# EAGLE design EEZ DIB AUX PS r1B1 (EAGLE 7.2.0)
Assembly variants: Farnell, TME

## Sheet 1 of 2: Power board tester
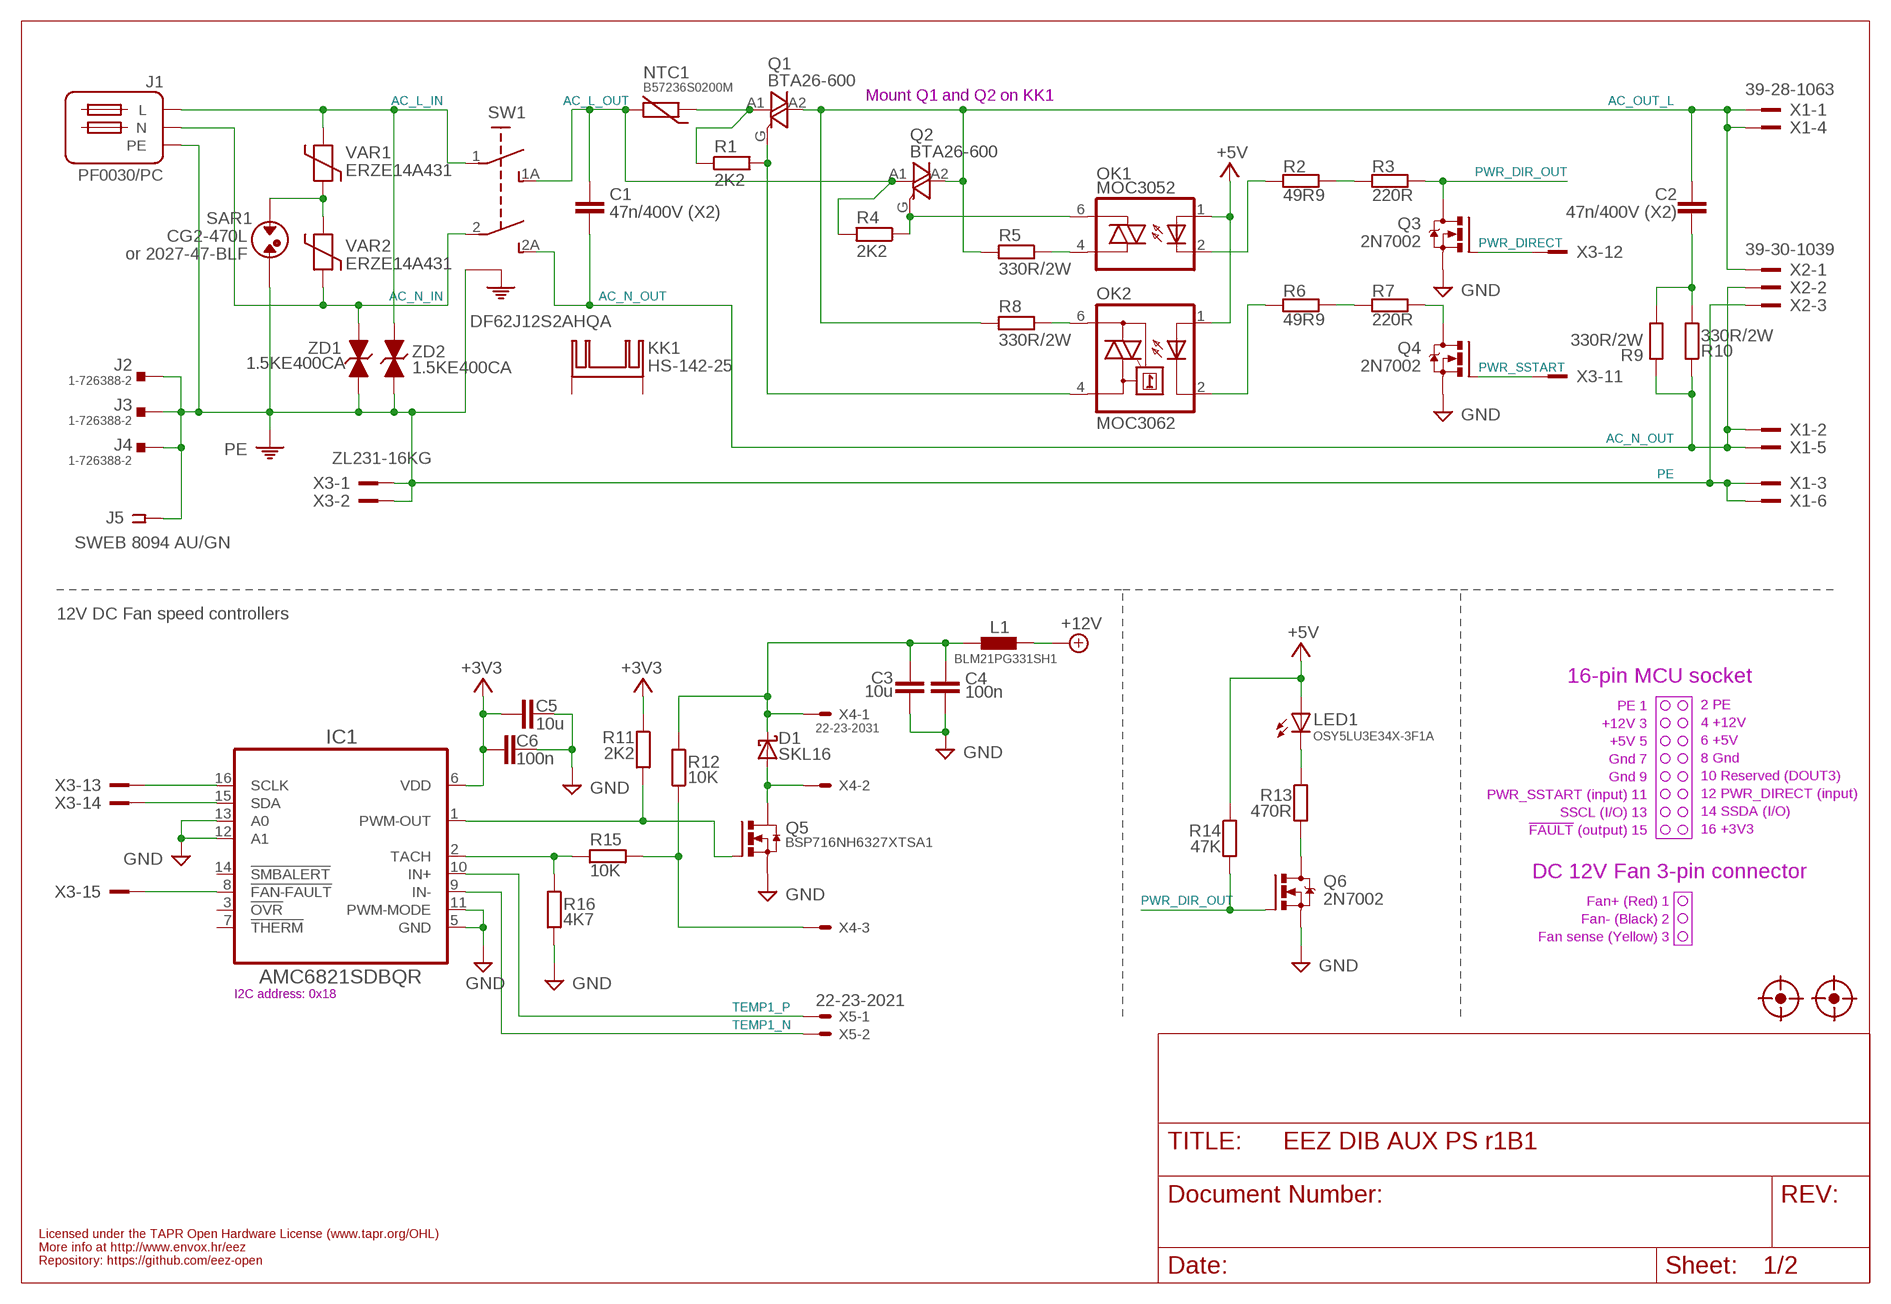
[diagram p0: schematic, sheet 1]

### Parts
C1  47n/400V (X2)  C-EU102-054X133  [C102-054X133]
C2  47n/400V (X2)  C-EU102-054X133  [C102-054X133]
C3  10u  C-EUC1206  [C1206]
C4  100n  C-EUC0603  [C0603]
C5  10u  C-EUC1206  [C1206]
C6  100n  C-EUC0603  [C0603]
D1  SKL16  SCHOTTKYSOD123  [SOD123]
FM1  FIDUCIAL  [FIDUCIAL]
FM2  FIDUCIAL  [FIDUCIAL]
IC1  AMC6821SDBQR  AMC6821  [DBQ16]
J1  PF0030/PC  [PF0030/PC]
J2  1-726388-2  PCB_TAB4.8MM  [PCB_TAB-4.8MM]
J3  1-726388-2  PCB_TAB4.8MM  [PCB_TAB-4.8MM]
J4  1-726388-2  PCB_TAB4.8MM  [PCB_TAB-4.8MM]
J5  SWEB 8094 AU/GN  BINDING_POSTCLIFF  [S16N-PC]
KK1  HS-142-25  SK129-PAD  [SK129]
L1  BLM21PG331SH1  L-EU0805  [0805]
LED1  OSY5LU3E34X-3F1A  LEDOSG8  [OSG8]
NTC1  B57236S0200M  NTC11.5X6  [NTC_11.5X6_RM5]
OK1  MOC3052  MOC305X  [DIL6-SMD]
OK2  MOC3062  MOC3033S  [DIL6-SMD]
Q1  BTA26-600  BTA26-V  [TOP3S-1]
Q2  BTA26-600  BTA26-V  [TOP3S-1]
Q3  2N7002  [SOT103P240X110-3N]
Q4  2N7002  [SOT103P240X110-3N]
Q5  BSP716NH6327XTSA1  N-HEXFET-2D_SOT232-IRLL014N  [SOT223]
Q6  2N7002  [SOT103P240X110-3N]
R1  2K2  R-EU_R0805  [R0805]
R2  49R9  R-EU_R0805  [R0805]
R3  220R  R-EU_R0805  [R0805]
R4  2K2  R-EU_R0805  [R0805]
R5  330R/2W  R-EU_R2512  [R2512]
R6  49R9  R-EU_R0805  [R0805]
R7  220R  R-EU_R0805  [R0805]
R8  330R/2W  R-EU_R2512  [R2512]
R9  330R/2W  R-EU_R2512  [R2512]
R10  330R/2W  R-EU_R2512  [R2512]
R11  2K2  R-EU_R0805  [R0805]
R12  10K  R-EU_R0805  [R0805]
R13  470R  R-EU_R0805  [R0805]
R14  47K  R-EU_R0805  [R0805]
R15  10K  R-EU_R0805  [R0805]
R16  4K7  R-EU_R0805  [R0805]
SAR1  CG2-470L  SAR  [SAR]
SW1  DF62J12S2AHQA  [DF62J12S2]
VAR1  ERZE14A431  VARISTOR-13  [VARISTOR_13MM]
VAR2  ERZE14A431  VARISTOR-13  [VARISTOR_13MM]
X1  39-28-1063  MINIFIT_5566-06A-CRE  [MINIFIT_5566-06A_CRE]
X2  39-30-1039  MINIFIT_39301039-CREEPAGE  [MINIFIT_39301039_CRE]
X3  ZL231-16KG  IDC-16PIN-ANGLED  [ML16L]
X4  22-23-2031  [22-23-2031]
X5  22-23-2021  [22-23-2021]
ZD1  1.5KE400CA  1.5KE-BIDIR  [DO201-BIDIR]
ZD2  1.5KE400CA  1.5KE-BIDIR  [DO201-BIDIR]

### Nets
+3V3: C5.2 C6.2 IC1.6(VDD) R11.1 ; also sheet 2
+5V: LED1.A OK1.1(A) OK2.1(A) R14.1 ; also sheet 2
+12V: L1.2 ; also sheet 2
AC_L_IN: J1.L SW1.1(P) VAR1.2 ZD2.A
AC_L_OUT: C1.1 NTC1.1 Q2.A1 R4.2 SW1.1A(S) ; also sheet 2
AC_N_IN: J1.N SW1.2(P1) VAR2.1 ZD1.A
AC_N_OUT: C1.2 R9.1 R10.1 SW1.2A(S1) X1.2 X1.5 X2.2 ; also sheet 2
AC_OUT_L: C2.1 Q1.A2 Q2.A2 R5.2 R8.2 X1.1 X1.4 X2.1
FAN_OUT: D1.A Q5.2(D) Q5.4(D) X4.2
FAN_SENSE: R12.1 R15.2 X4.3
GND [gnd]: C3.2 C4.2 C5.1 C6.1 IC1.5(GND) IC1.11(PWM-MODE) IC1.12(A1) IC1.13(A0) Q3.2(S) Q4.2(S) Q5.3(S) Q6.2(S) R16.2 ; also sheet 2
N$1: NTC1.2 Q1.A1 R1.1
N$2: IC1.2(TACH) R15.1 R16.1
N$6: SAR1.P$1 VAR1.1 VAR2.2
N$13: Q6.3(D) R13.2
N$14: LED1.C R13.1
N$16: Q4.3(D) R7.2
N$58: IC1.1(PWM-OUT) Q5.1(G) R11.2
N$63: C3.1 C4.1 D1.C L1.1 R12.2 X4.1
N$71: OK1.6(A2) Q2.G R4.1
N$72: OK2.4(A1) Q1.G R1.2
N$73: OK2.6(A2) R8.1
N$74: R2.2 R3.1
N$75: R6.2 R7.1
N$76: OK1.4(A1) R5.1
N$83: C2.2 R9.2 R10.2
N$174: OK2.2(C) R6.1
N$175: OK1.2(C) R2.1
NFAULT: IC1.8(!FAN-FAULT) X3.15
PE: J1.PE J2.P$1 J2.P$2 J3.P$1 J3.P$2 J4.P$1 J4.P$2 J5.1 J5.NC1 J5.NC2 J5.NC3 J5.NC4 SAR1.P$2 SW1.PE1(PE) SW1.PE2(PE) X1.3 X1.6 X2.3 X3.1 X3.2 ZD1.C ZD2.C ; also sheet 2
PWR_DIR_OUT: Q3.3(D) Q6.1(G) R3.2 R14.2
PWR_DIRECT: Q3.1(G) X3.12
PWR_SSTART: Q4.1(G) X3.11
SSCL: IC1.16(SCLK) X3.13
SSDA: IC1.15(SDA) X3.14
TEMP1_N [diff]: IC1.9(IN-) X5.2
TEMP1_P [diff]: IC1.10(IN+) X5.1
Unconnected: IC1.3(!OVR) IC1.7(!THERM) IC1.14(!SMBALERT) KK1.A2,5(K) KK1.B2,5(K) X3.10

### Notes on the sheet
- Mount Q1 and Q2 on KK1
- or 2027-47-BLF
- 12V DC Fan speed controllers
- 16-pin MCU socket
- PE 1
- 2 PE
- +12V 3
- 4 +12V
- +5V 5
- 6 +5V
- Gnd 7
- 8 Gnd
- Gnd 9
- 10 Reserved (DOUT3)
- PWR_SSTART (input) 11
- 12 PWR_DIRECT (input)
- SSCL (I/O) 13
- 14 SSDA (I/O)
- !FAULT! (output) 15
- 16 +3V3
- DC 12V Fan 3-pin connector
- Fan+ (Red) 1
- Fan- (Black) 2
- Fan sense (Yellow) 3
- I2C address: 0x18
- Licensed under the TAPR Open Hardware License (www.tapr.org/OHL)
- More info at http://www.envox.hr/eez
- Repository: https://github.com/eez-open

## Sheet 2 of 2
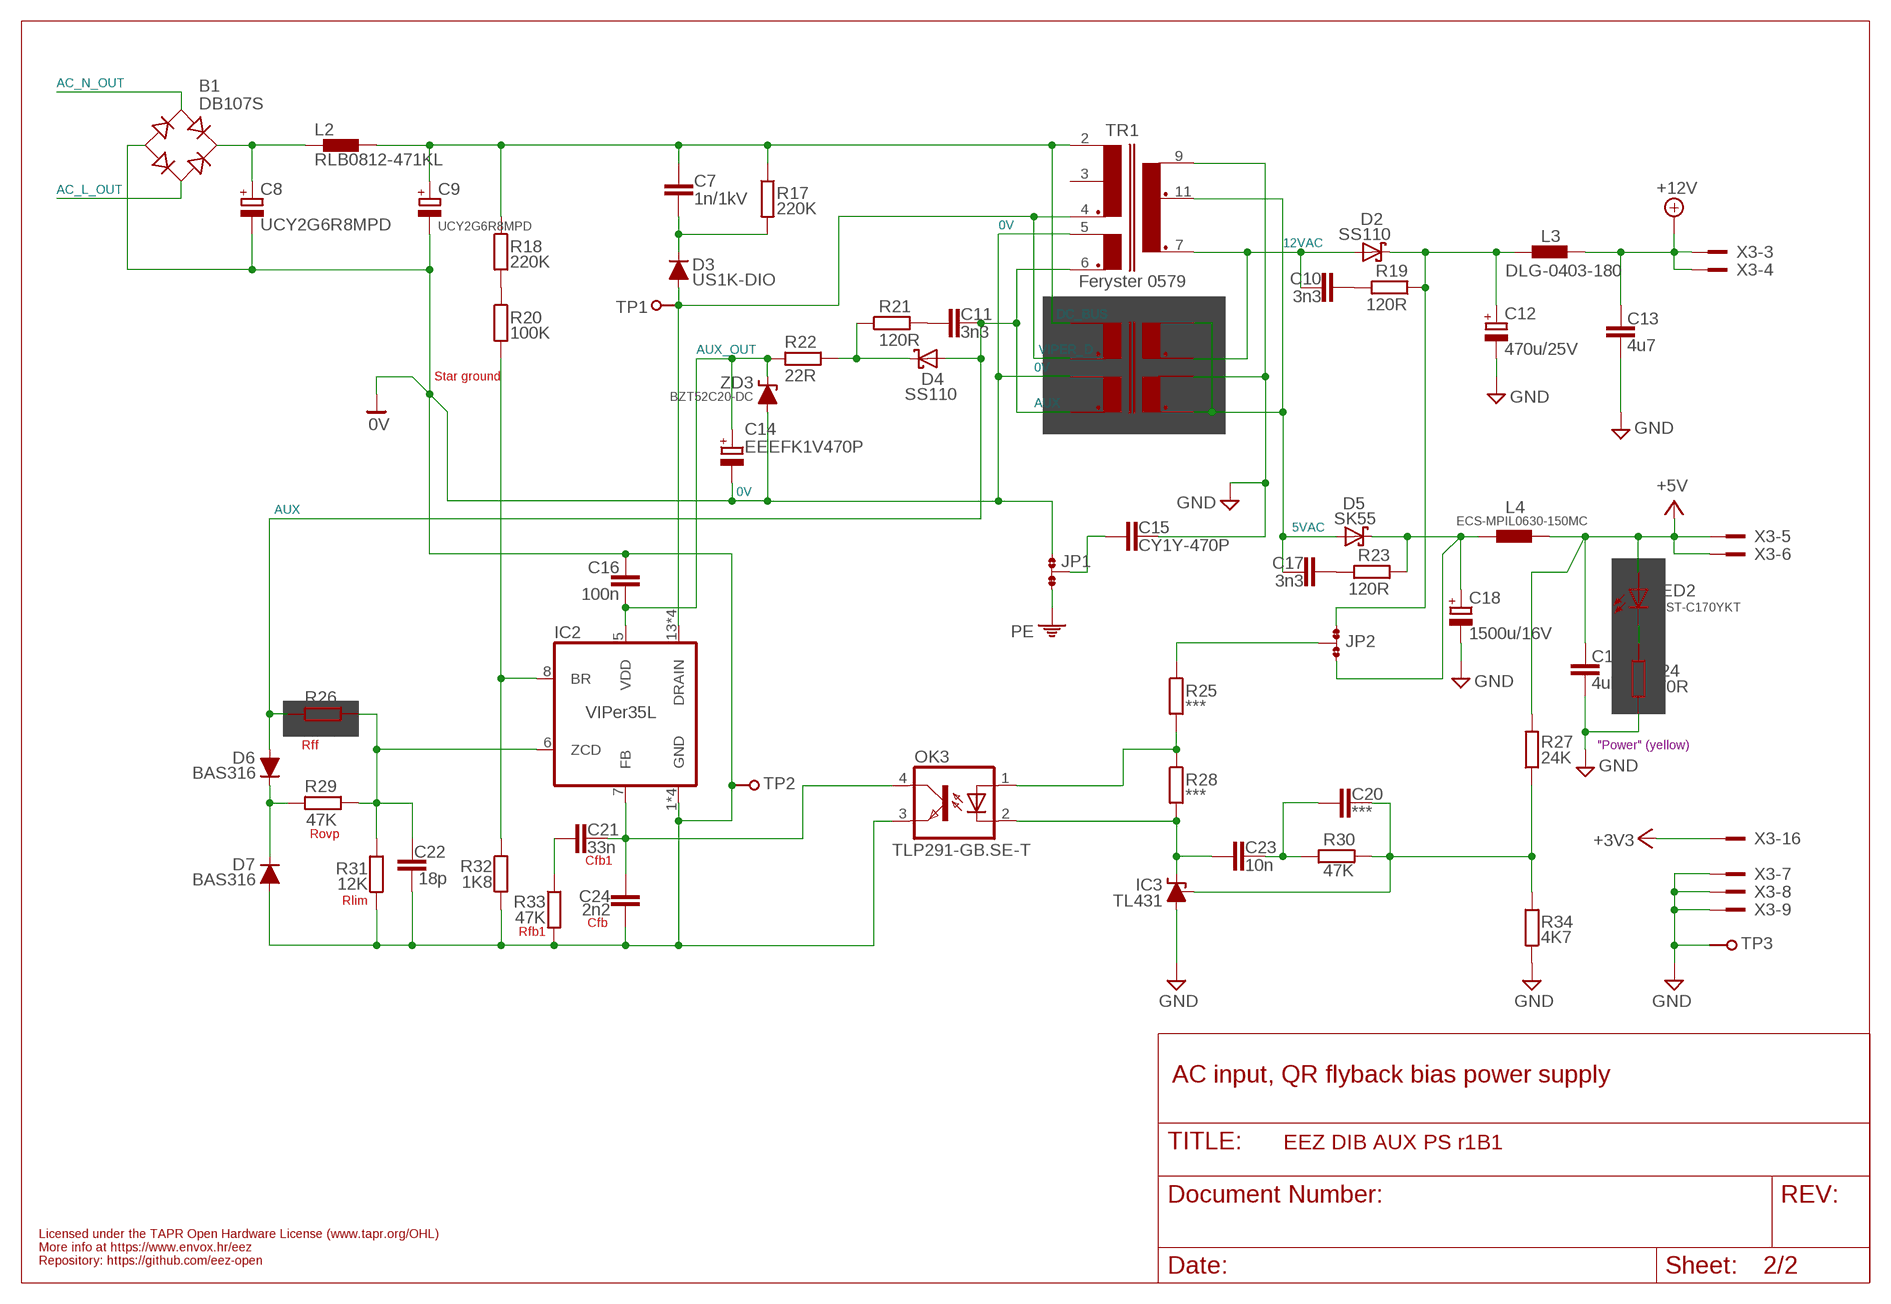
[diagram p1: schematic, sheet 2]

### Parts
B1  DB107S  DBS107G  [DBS]
C7  1n/1kV  C-EUC1210  [C1210]
C8  UCY2G6R8MPD  ECAP5G_10.5MM  [ECAP5/10.5]
C9  UCY2G6R8MPD  ECAP5G_10.5MM  [ECAP5/10.5]
C10  3n3  C-EUC0805  [C0805]
C11  3n3  C-EUC0805  [C0805]
C12  470u/25V  ECAP5G_10.5MM  [ECAP5/10.5]
C13  4u7  C-EUC1206  [C1206]
C14  EEEFK1V470P  ECAPPANASONIC_H  [CAPAE660X610N]
C15  CY1Y-470P  C-EUCY  [CY075-032X103]
C16  100n  C-EUC0603  [C0603]
C17  3n3  C-EUC0805  [C0805]
C18  1500u/16V  ECAP5G_13MM  [ECAP5/13]
C19  4u7  C-EUC1206  [C1206]
C20  ***  C-EUC0805  [C0805]
C21  33n  C-EUC0805  [C0805]
C22  18p  C-EUC0603  [C0603]
C23  10n  C-EUC0805  [C0805]
C24  2n2  C-EUC0805  [C0805]
D2  SS110  SCHOTTKYSMB  [SMB]
D3  US1K-DIO  DIODEDO214AA  [DO214AA]
D4  SS110  SCHOTTKYSMB  [SMB]
D5  SK55  SCHOTTKYSMB  [SMB]
D6  BAS316  DIODESOD323R  [SOD323-R]
D7  BAS316  DIODESOD323R  [SOD323-R]
IC2  VIPer35L  VIPER35  [SOIC-16]
IC3  TL431  [SOT103P240X110-3N]
JP1  JP3-CUT  [JP3-CUT]
JP2  JP3-CUT  [JP3-CUT]
L2  RLB0812-471KL  FERYSTER_DSZ6  [FERSYTER_DSZ6]
L3  DLG-0403-180  DE0403  [DE0403]
L4  ECS-MPIL0630-150MC  DE0704  [DE0704]
LED2  LTST-C170YKT  LED0805  [LED_0805]
OK3  TLP291-GB.SE-T  TLP291  [SO4]
R17  220K  R-EU_R1206  [R1206]
R18  220K  R-EU_R1206  [R1206]
R19  120R  R-EU_R0805  [R0805]
R20  100K  R-EU_R0805  [R0805]
R21  120R  R-EU_R0805  [R0805]
R22  22R  R-EU_R0805  [R0805]
R23  120R  R-EU_R0805  [R0805]
R24  470R  R-EU_R0805  [R0805]
R25  ***  R-EU_R0805  [R0805]
R26  N.C.  R-EU_R0805  [R0805]
R27  24K  R-EU_R0805  [R0805]
R28  ***  R-EU_R0805  [R0805]
R29  47K  R-EU_R0805  [R0805]
R30  47K  R-EU_R0805  [R0805]
R31  12K  R-EU_R0805  [R0805]
R32  1K8  R-EU_R0805  [R0805]
R33  47K  R-EU_R0805  [R0805]
R34  4K7  R-EU_R0805  [R0805]
TP1  PCB_TEST_TABSHIELD  [PCB_SHIELD_TAB]
TP2  PCB_TEST_TABSHIELD  [PCB_SHIELD_TAB]
TP3  PCB_TEST_TABSHIELD  [PCB_SHIELD_TAB]
TR1  Feryster 0579  FERYSTER_0579  [FERYSTER_0579]
TR1B  (WE 760875532)  WE-UOST  [WE-UOST]
ZD3  BZT52C20-DC  ZENER-DIODESOD123  [SOD123]

### Nets
0V: B1.- C8.- C9.- C14.2(-) C16.1 C22.2 C24.2 D7.A IC2.1(GND) IC2.2(GND) IC2.3(GND) IC2.4(GND) JP1.NO OK3.3(EMIT) R31.1 R32.2 R33.2 TP2.1 TR1.5(AUX) TR1B.11(AUX) ZD3.A
5VAC: C17.2 D5.A TR1.11(S1_DOT) TR1B.2(S1) TR1B.3(S2_DOT) TR1B.4(S2_DOT)
12VAC: C10.2 D2.A TR1.7(S2_DOT) TR1B.1(S1_DOT)
+3V3: X3.16 ; also sheet 1
+5V: C19.1 L4.2 LED2.A R27.2 X3.5 X3.6 ; also sheet 1
+5V_REC: C18.+ D5.C JP2.NO L4.1 R23.1
+12V: C13.1 L3.2 X3.3 X3.4 ; also sheet 1
+12V_REC: C12.+ D2.C JP2.NC L3.1 R19.1
AC_L_OUT: B1.AC2 ; also sheet 1
AC_N_OUT: B1.AC1 ; also sheet 1
AUX: C11.2 D4.A D6.A R26.2 TR1.6(AUX_DOT) TR1B.12(AUX_DOT)
AUX_OUT: C14.1(+) C16.2 IC2.5(VDD) R22.2 ZD3.C
AUX_REC: D4.C R21.1 R22.1
DC_BUS: C7.1 C9.+ L2.P$2 R17.1 R18.1 TR1.2(P1) TR1B.7(P1)
FB1: C23.1 IC3.1(C) OK3.2(C) R28.2
GND [gnd]: C12.- C13.2 C15.2 C18.- C19.2 IC3.3(A) R24.2 R34.1 TP3.1 TR1.9(S_COMM) TR1B.5(S2) TR1B.6(S2) X3.7 X3.8 X3.9 ; also sheet 1
N$4: C15.1 JP1.COM
N$5: OK3.1(A) R25.2 R28.1
N$8: C10.1 R19.2
N$9: B1.+ C8.+ L2.P$1
N$10: LED2.C R24.1
N$12: JP2.COM R25.1
N$20: IC2.8(BR) R20.2 R32.1
N$49: R18.2 R20.1
N$137: C7.2 D3.C R17.2
N$138: C21.2 C24.1 IC2.7(FB) OK3.4(COL)
N$140: C11.1 R21.2
N$141: C22.1 IC2.6(ZCD) R26.1 R29.1 R31.2
N$146: C17.1 R23.2
N$148: C20.2 IC3.2(REF) R27.1 R30.2 R34.2
N$149: C20.1 C23.2 R30.1
N$152: C21.1 R33.1
N$155: D6.C D7.C R29.2
PE: JP1.NC ; also sheet 1
VIPER_D: D3.A IC2.13(DRAIN) IC2.14(DRAIN) IC2.15(DRAIN) IC2.16(DRAIN) TP1.1 TR1.4(P1_DOT) TR1B.9(P1_DOT)
Unconnected: TR1.3(P1_MIDDLE)

### Notes on the sheet
- Star ground
- Rff | "Power" (yellow)
- Rovp
- Cfb1
- Rlim
- Cfb
- Rfb1
- AC input, QR flyback bias power supply
- Licensed under the TAPR Open Hardware License (www.tapr.org/OHL)
- More info at https://www.envox.hr/eez
- Repository: https://github.com/eez-open

## Library data of the parts
B1 = rectifier:DB?*G: Single Phase 1.0 AMP Glass Passivated Bridge Rectifier Taiwan Semiconductor Co.,Ltd. - TSC Source: http://www.taiwansemi.com/TSCbig5/ezcatfiles/cust/img/img/db101g.pdf http://www.ts.com.tw/db/pictures/modules/PDT/PDT060207001/DBLS201G.pdf
C1-C7 C10 C11 C13 C16 C17 C19-C24 = rcl:C-EU: CAPACITOR, European symbol
C8 C9 C12 C14 C18 = EEZ_Lib1:ECAP
C15 = EEZ_Lib1:C-EU
D1 D2 D4 D5 = EEZ_Lib1:SCHOTTKY
D3 D6 D7 = EEZ_Lib1:DIODE
FM1 FM2 = EEZ_Lib1:FIDUCIAL: Fiducial mark for pick and place automation
IC1 = EEZ_DIB:AMC6821: Intelligent Temperature Monitor and PWM Fan Controller, I2C; DATASHEETURL: httpwww.ti.comlitgpnAMC6821; FAMILY_NAME: TEMP MONITORING AND FAN CONTROL; GENERIC_PART_NUMBER: AMC6821; INDUSTRY_STD_PKG_TYPE: SSOPQSOP; MANUFACTURER: Texas Instruments; PACKAGE_DESIGNATOR: DBQ; PIN_COUNT: 16
IC2 = EEZ_Lib1:VIPER35: Quasi-resonant high performance off line high voltage converter, 800 V
IC3 = EEZ_Lib1:TL431: Precision programmable reference
J1 = EEZ_connectors:PF0030/PC: PC Flanged Mount Fused Inlet, twin fused 5 x 20 mm, 250 Vac, 10 A, PC spills
J2-J4 = EEZ_connectors:PCB_TAB
J5 = EEZ_Lib1:BINDING_POST: Various 4 mm binding posts
JP1 JP2 = EEZ_Lib1:JP3-CUT: 2-way SMT jumper with one position connected
KK1 = EEZ_DIB:SK129-PAD: Extruded heatsink; SOT32,TO220,TO3P; L:25.4mm; 7.8K/W Compatible model: Stonecold HS-142-25
L1 = EEZ_Lib1:L-EU
L2 = EEZ_Lib1:FERYSTER_DSZ6: Feryster DSZ type choke on RSZ ferrite core
L3 = EEZ_inductors_and_transformers:DE0403: Ferrocore SMD power coil 4.0 x 4.5 mm
L4 = EEZ_inductors_and_transformers:DE0704: Ferrocore SMD power coil 7.3 x 7.3 mm
LED1 LED2 = EEZ_Lib1:LED
NTC1 = EEZ_Lib1:NTC
OK1 = EEZ_Lib1:MOC305X: 6-pin DIP Random-phase Optoisolators Triac Drivers (600V Peak)
OK2 = optocoupler:MOC30*: 6-Pin DIP Zero-Cross Optoisolators Triac Driver Output (250/400 Volt Peak) Source: http://www.fairchildsemi.com/ds/MO/MOC3043-M.pdf; MF: FAIRCHILD SEMICONDUCTOR; MPN: MOC3033S-M; OC_FARNELL: unknown; OC_NEWARK: 05C2878
OK3 = EEZ_Lib1:TLP291: Toshiba Photocopler GaAs IRED & Photo-transistor
Q1 Q2 = triac:BTA26: 25A TRIAC Source: http://www.st.com/stonline/products/literature/ds/7470.pdf
Q3 Q4 Q6 = EEZ_Lib1:2N7002: N-CHANNEL ENHANCEMENT MODE FIELD EFFECT TRANSISTOR; MPN: 2N7002-7-F; OC_FARNELL: 1713823; OC_NEWARK: 25R5679; PACKAGE: SOT-23-3; SUPPLIER: DIODES INC.
Q5 = transistor-power:N-HEXFET-2D_?-*: HEXFET® Power MOSFET 2 Drain connects http://www.irf.com/product-info/datasheets/data/irll014n.pdf
R1-R34 = rcl:R-EU_: RESISTOR, European symbol
SAR1 = EEZ_Lib1:SAR: EPCOS surge arrester EF470X Farnell: 1886596
SW1 = EEZ_switches:DF62J12S2: Rocker switch SPST; Positions:2; OFF-ON; 16A/250VAC; 6A/48VDC
TP1-TP3 = EEZ_Lib1:PCB_TEST_TAB
TR1 = EEZ_inductors_and_transformers:FERYSTER_0579: Flyback transformer, 1.04mH, 35W
TR1B = EEZ_Lib1:WE-UOST: WE-UOST Universal Offline Standard Transformers
VAR1 VAR2 = EEZ_Lib1:VARISTOR: EPCOS - B72220S0251K101 - VARISTOR, 140J, 250VAC Farnell: 1004357
X1 = EEZ_connectors:MINIFIT_5566-06A: Molex Socket; wire-board; male; Mini-Fit Jr; 4.2mm; PIN:6; THT; 9A; tinned
X2 = EEZ_connectors:MINIFIT_39301039: MOLEX socket; wire-board; male; Mini-Fit Jr; 4.2mm; PIN:3; THT; PCB snap
X3 = EEZ_connectors:IDC-16PIN: 16-pin IDC socket
X4 = con-molex:22-23-2031: .100" (2.54mm) Center Header - 3 Pin; MF: MOLEX; MPN: 22-23-2031; OC_FARNELL: 1462950; OC_NEWARK: 30C0862
X5 = con-molex:22-23-2021: .100" (2.54mm) Center Header - 2 Pin; MF: MOLEX; MPN: 22-23-2021; OC_FARNELL: 1462926; OC_NEWARK: 25C3832
ZD1 ZD2 = EEZ_Lib1:1.5KE-BIDIR
ZD3 = EEZ_Lib1:ZENER-DIODE

## Net classes
0 default: width 0.152 mm, drill 0.3 mm, clearance 0.152 mm
1 diff: width 0.254 mm, drill 0.3 mm, clearance 0.254 mm
2 gnd: width 0.152 mm, drill 0.3 mm, clearance 0.152 mm

## Board
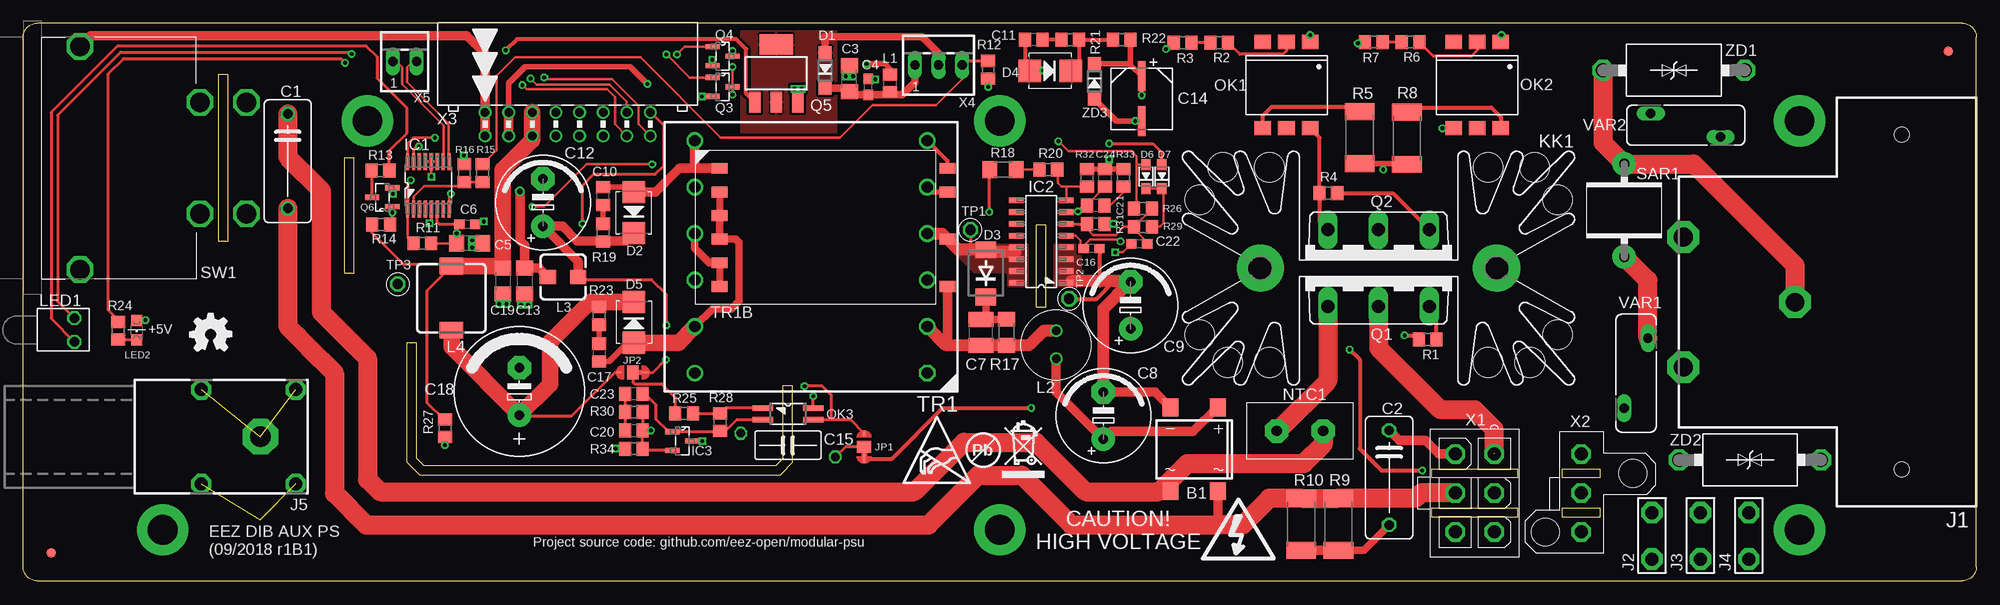
[diagram p2: board, top side]
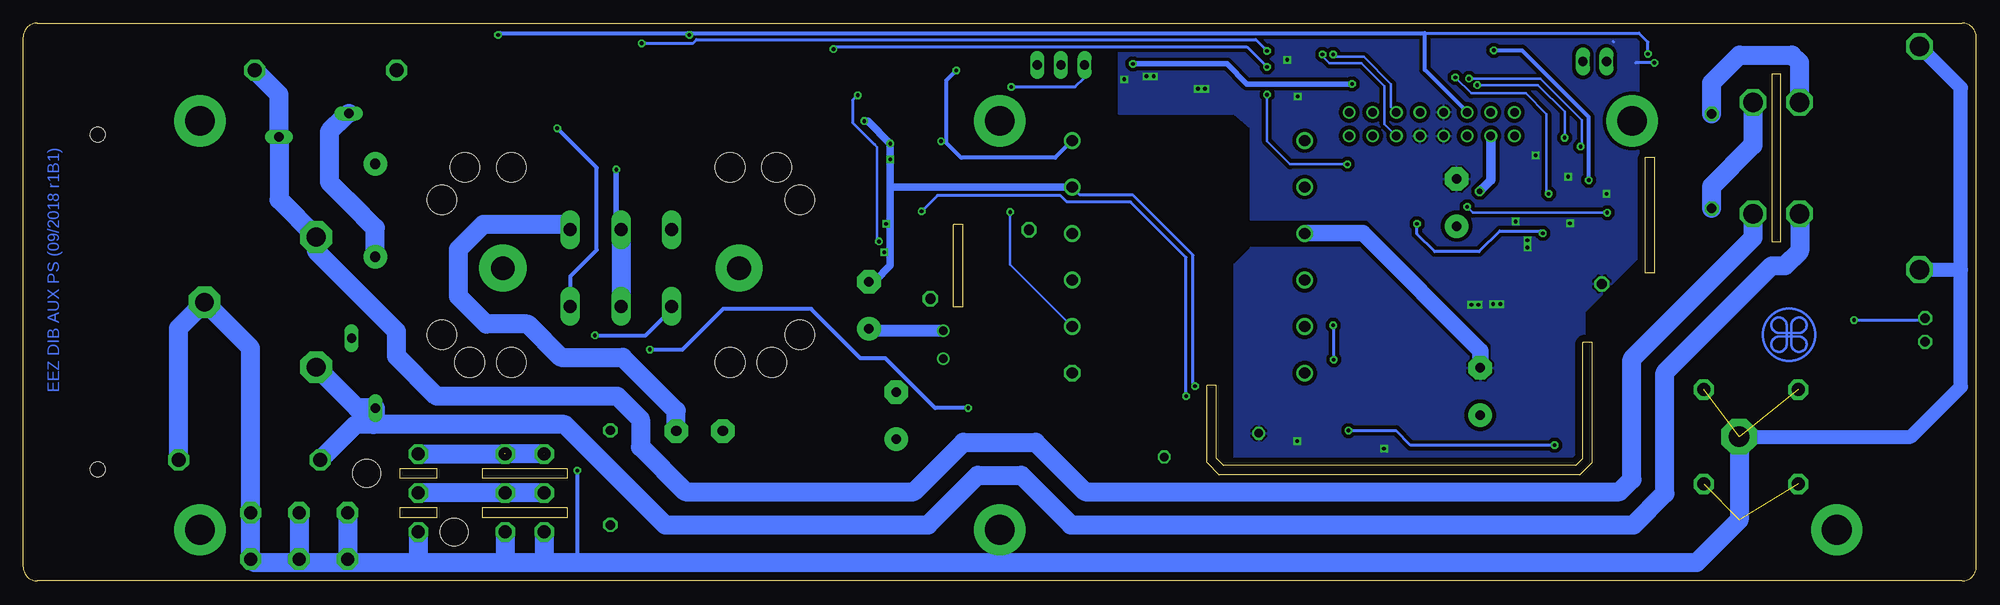
[diagram p3: board, bottom side, seen from below]

Size 210 x 60 mm. Coordinates in mm from the lower left corner, seen from the top.
Outline: 1.5,0 208.5,0 arc90 210,1.5 210,58.5 arc90 208.5,60 1.5,60 arc90 0,58.5 0,1.5 arc90 1.5,0
Outline: 42.61,11.43 81.41,11.43 82.74,12.76 82.74,21.02 81.72,21.02 81.72,13.21 80.96,12.45 43.05,12.45 42.29,13.21 42.29,25.65 41.27,25.65 41.27,12.76 42.61,11.43
Outline: 108.97,29.46 108.97,38.35 109.98,38.35 109.98,29.46 108.97,29.46
Outline: 34.54,33.15 34.54,45.53 35.56,45.53 35.56,33.15 34.54,33.15
Copper layers (1*16): Top 0.035mm / dielectric 1.5mm / Bottom 0.035mm
Design rules "default *": minimum track width 6mil, minimum drill 0.3mm, track to track 4mil, track to pad 4mil, pad to pad 4mil, via to via 4mil, smd to smd 4mil, copper to edge 30mil, drill to drill 8mil, minimum pad ring 4mil, minimum via ring 8mil, stop-mask expansion 2.5mil, vias tented up to drill 0.6mm, thermal gap 8mil
Holes 3.2 mm at 134,44.5 129,44.5 157.5,44.5 162.5,44.5 134,23.5 129.5,23.5 126.5,26.5 126.5,41 165,41 165,26.5 162,23.5 157.5,23.5

### Footprints (pad centres in the part's own frame; a part is rotated, then mirrored left to right if it is on the bottom)
DBS = smd 1.7 x 1.9: + -2.55,-4.5; - 2.55,-4.5; AC1 -2.55,4.5; AC2 2.55,4.5
C102-054X133 = drill 1.016 octagon: 1 -5.08,0; 2 5.08,0
C1206 = smd 1.6 x 1.8: 1 -1.4,0; 2 1.4,0
C0603 = smd 1.1 x 1: 1 -0.85,0; 2 0.85,0
C1210 = smd 1.6 x 2.7: 1 -1.4,0; 2 1.4,0
ECAP5/10.5 = drill 1.016 pad 2.54: + -2.54,0 | drill 1.016 pad 2.54 octagon: - 2.54,0
C0805 = smd 1.3 x 1.5: 1 -0.95,0; 2 0.95,0
CAPAE660X610N = smd 3.251 x 0.762: 1 -2.413,0; 2 2.413,0
CY075-032X103 = drill 0.914 octagon: 1 -5.08,1.27; 2 5.08,-1.27
ECAP5/13 = drill 1.016 pad 2.54: + -2.54,0 | drill 1.016 pad 2.54 octagon: - 2.54,0
SOD123 = smd 1.4 x 1.4: A 1.9,0; C -1.9,0
SMB = smd 2.4 x 2.4: A 2.2,0; C -2.2,0
DO214AA = smd 1.8 x 2.2: A 2.55,0; C -2.55,0
SOD323-R = smd 1.2 x 1: A 1.3,0; C -1.3,0
FIDUCIAL = smd 1.016 x 1.016: T 0,0
DBQ16 = smd 1.803 x 0.356: 1 -2.553,2.223; 2 -2.553,1.587; 3 -2.553,0.953; 4 -2.553,0.318; 5 -2.553,-0.318; 6 -2.553,-0.953; 7 -2.553,-1.587; 8 -2.553,-2.223; 9 2.553,-2.223; 10 2.553,-1.587; 11 2.553,-0.953; 12 2.553,-0.318; 13 2.553,0.318; 14 2.553,0.953; 15 2.553,1.587; 16 2.553,2.223
SOIC-16 = smd 1.549 x 0.61: 1 -2.692,4.445; 2 -2.692,3.175; 3 -2.692,1.905; 4 -2.692,0.635; 5 -2.692,-0.635; 6 -2.692,-1.905; 7 -2.692,-3.175; 8 -2.692,-4.445; 9 2.692,-4.445; 10 2.692,-3.175; 11 2.692,-1.905; 12 2.692,-0.635; 13 2.692,0.635; 14 2.692,1.905; 15 2.692,3.175; 16 2.692,4.445
SOT103P240X110-3N = smd 1.524 x 0.559: 1 -1.079,1.016; 2 -1.079,-1.016; 3 1.079,0
PF0030/PC = drill 2 pad 3.4 octagon: L -7,31.5; N 7,31.5; PE 0,19.5 | hole 1.6: 18,8; -18,8
PCB_TAB-4.8MM = drill 1.4 pad 2.3 octagon: P$1 -2.54,0; P$2 2.46,0
S16N-PC = drill 2.2 pad 3.81 octagon: 1 0,0 | drill 1.4 pad 2.184 octagon: NC1 -3.8,5.08; NC2 -3.8,-5.08; NC3 6.36,5.08; NC4 6.36,-5.08
JP3-CUT = smd 1.27 x 1.524: COM 0,0 | smd 0.889 x 0.254: NC -1.27,0 | smd 0.508 x 0.254: NO 1.46,0
SK129 = drill 2.54 pad 5.08: A2,5 -12.7,-0.889; B2,5 12.7,-0.889
0805 = smd 1.3 x 1.5: 1 -0.95,0; 2 0.95,0
FERSYTER_DSZ6 = drill 0.9: P$1 -1.5,0; P$2 1.5,0
DE0403 = smd 1.5 x 1.75: 1 0,1.626; 2 0,-1.625
DE0704 = smd 2.5 x 1.8: 1 0,3.45; 2 0,-3.45
OSG8 = drill 1 octagon: A 0,1.27; C 0,-1.27
LED_0805 = smd 1.2 x 1.2: A 0,-1.05; C 0,1.05
NTC_11.5X6_RM5 = drill 1.1 pad 2.54 octagon: 1 -2.5,0; 2 2.5,0
DIL6-SMD = smd 1.78 x 1.52: 1 -2.54,-4.645; 2 0,-4.645; 3 2.54,-4.645; 4 2.54,4.645; 5 0,4.645; 6 -2.54,4.645
SO4 = smd 0.6 x 2.2: 1 -0.635,-2.7; 2 0.635,-2.7; 3 0.635,2.7; 4 -0.635,2.7
TOP3S-1 = drill 1.397 long: A1 -5.461,-3.175; A2 0,-3.175; G 5.461,-3.175
SOT223 = smd 1.219 x 2.235: 1 -2.311,-3.099; 2 0,-3.099; 3 2.311,-3.099 | smd 3.6 x 2.2: 4 0,3.099
R0805 = smd 1.3 x 1.5: 1 -0.95,0; 2 0.95,0
R2512 = smd 1.8 x 3.2: 1 -2.8,0; 2 2.8,0
R1206 = smd 1.6 x 1.803: 1 -1.422,0; 2 1.422,0
SAR = drill 1.1 pad 2.54: P$1 0,0; P$2 10,0
DF62J12S2 = drill 2.1 octagon: 1 17,-6; 1A 17,6; 2 22,-6; 2A 22,6; PE1 4.1,-12; PE2 4.1,12
PCB_SHIELD_TAB = drill 1.1 octagon: 1 0,0
FERYSTER_0579 = drill 1.2 octagon: 1 -12.5,12.5 | drill 1.2: 2 -12.5,7.5; 3 -12.5,2.5; 4 -12.5,-2.5; 5 -12.5,-7.5; 6 -12.5,-12.5; 7 12.5,-12.5; 8 12.5,-7.5; 9 12.5,-2.5; 10 12.5,2.5; 11 12.5,7.5; 12 12.5,12.5
WE-UOST = smd 1.7 x 1.17: 1 -12.265,6.35; 2 -12.265,3.81; 3 -12.265,1.27; 4 -12.265,-1.27; 5 -12.265,-3.81; 6 -12.265,-6.35; 7 12.265,-6.35; 9 12.265,-1.27; 11 12.265,3.81; 12 12.265,6.35
VARISTOR_13MM = drill 1.016 long: 1 3.75,-1.27; 2 -3.75,1.27
MINIFIT_5566-06A_CRE = drill 1.4 octagon: 1 -4.2,2.1; 2 0,2.1; 3 4.2,2.1; 4 -4.2,-2.1; 5 0,-2.1; 6 4.2,-2.1
MINIFIT_39301039_CRE = drill 1.4 octagon: 1 0,4.2; 2 0,0; 3 0,-4.2 | hole 3: 5.55,2.1; -3.85,-4.2
ML16L = drill 0.914: 1 -8.89,-1.27; 2 -8.89,1.27; 3 -6.35,-1.27; 4 -6.35,1.27; 5 -3.81,-1.27; 6 -3.81,1.27; 7 -1.27,-1.27; 8 -1.27,1.27; 9 1.27,-1.27; 10 1.27,1.27; 11 3.81,-1.27; 12 3.81,1.27; 13 6.35,-1.27; 14 6.35,1.27; 15 8.89,-1.27; 16 8.89,1.27
22-23-2031 = drill 1 long: 1 -2.54,0; 2 0,0; 3 2.54,0
22-23-2021 = drill 1 long: 1 -1.27,0; 2 1.27,0
DO201-BIDIR = drill 1.499 octagon: A 7.62,0; C -7.62,0

### Placement (x,y rotation side)
B1  125.92,14.16 180 top
C1  28.44,45.16 270 top
C2  146.88,11.11 270 top
C3  88.84,54.04 90 top
C4  90.87,53.15 90 top
C5  48.01,36.32 180 top
C6  47.75,38.35 180 top
C7  103,26.73 90 top
C8  116.14,17.78 90 top
C9  119.06,29.65 90 top
C10  62.36,41.4 90 top
C11  108.65,58.23 180 top
C12  55.88,40.7 90 top
C13  53.91,32.26 270 top
C14  120.27,51.88 270 top
C15  82.23,14.61 180 top
C16  114.87,35.75 180 top
C17  61.91,24.57 270 top
C18  53.34,20.38 90 top
C19  51.56,32.26 270 top
C20  65.66,16.19 0 top
C21  115.32,40.39 180 top
C22  120.02,36.26 180 top
C23  65.66,20.13 180 top
C24  116.33,43.37 90 top
D1  86.23,54.93 90 top
D2  65.66,39.62 90 top
D3  103.5,33.08 90 top
D4  110.43,54.86 180 top
D5  65.66,27.81 270 top
D6  120.71,43.5 90 top
D7  122.43,43.5 90 top
EEZ_SIGNATURE  SIGNATURESMALL  [SIGNATURE_5MM]  20.14,26.49 180 top
FM1  3,3 0 top
FM2  207,57 0 top
IC1  43.56,42.56 90 top
IC2  109.47,36.51 180 top
IC3  70.87,15.05 0 top
J1  210,30 90 top
J2  175.13,4.89 90 top
J3  180.34,4.89 90 top
J4  185.55,4.89 90 top
J5  25.5,15.5 180 top
JP1  90.42,14.41 90 top
JP2  65.55,22.42 180 top
KK1  145.73,34.54 0 top
L1  93.22,53.53 90 top
L2  111.06,25.4 90 top
L3  58.04,32.7 270 top
L4  46.04,30.42 180 top
LED1  5.5,27 0 top
LED2  12.19,26.99 180 top
NTC1  137.29,16.13 180 top
OK1  135.83,53.34 180 top
OK2  156.34,53.34 180 top
OK3  82.23,17.97 270 top
Q1  145.73,32.7 0 top
Q2  145.73,34.61 180 top
Q3  75.18,53.15 0 top
Q4  75.18,56.45 0 top
Q5  80.96,54.61 0 top
Q6  38.61,41.27 180 top
R1  151,25.97 0 top
R2  128.59,57.91 180 top
R3  124.65,57.91 180 top
R4  140.34,41.72 0 top
R5  143.7,47.69 270 top
R6  149.16,57.98 180 top
R7  145.22,57.98 180 top
R8  148.78,47.62 270 top
R9  141.41,6.1 270 top
R10  137.41,6.1 270 top
R11  42.93,36.32 180 top
R12  103.76,54.99 270 top
R13  38.42,44.13 180 top
R14  38.48,38.35 0 top
R15  49.4,43.88 90 top
R16  47.43,43.88 90 top
R17  105.73,26.73 90 top
R18  105.35,44.26 0 top
R19  62.36,37.47 90 top
R20  110.24,44.26 0 top
R21  112.59,58.23 180 top
R22  118.11,58.23 0 top
R23  61.91,28.51 270 top
R24  10.22,26.92 90 top
R25  71.06,18.03 0 top
R26  120.4,40.07 180 top
R27  45.37,16.43 90 top
R28  74.93,17.08 270 top
R29  120.4,38.1 0 top
R30  65.66,18.16 0 top
R31  115.32,38.42 180 top
R32  114.36,43.37 90 top
R33  118.3,43.37 90 top
R34  65.66,14.22 0 top
SAR1  172.15,34.86 90 top
SW1  2,45.5 0 top
TP1  101.85,37.78 0 top
TP2  112.46,30.35 0 top
TP3  40.26,31.94 0 top
TR1  84.71,34.86 180 top
TR1B  87.12,38.04 0 top
U$2  [PB_SMALL]  103.22,14.07 180 top
U$3  [RECYCLE_BIN1/8]  105.26,11.09 0 top
U$4  [ESD_SYMBOL]  94.68,10.56 0 top
VAR1  173.42,22.35 90 top
VAR2  178.75,49.02 0 top
X1  156.08,9.46 270 top
X2  167.51,9.46 0 top
X3  58.55,49.15 0 top
X4  98.42,55.5 0 top
X5  41.02,55.88 0 top
ZD1  177.48,54.93 0 top
ZD2  185.67,13.02 180 top
ZD3  115.19,53.72 270 top

### Tracks (layer width: path | path; a pad name or v marks a point on that pad's centre or on a via)
0V  (via drill 0.4)
  Top 0.254: v116.78,45.34 116.78,44.77 C24.2 | R31.1 v117.22,38.42 | v117.41,35.37 118.28,35.37 C22.2
  Top 0.305: OK3.3 84.93,17.37 86.93,17.37 | 86.93,17.37 86.93,19.94 85.92,20.95 v84.01,20.95 | 86.93,17.37 88.93,17.37 JP1.NO | D7.A 122.43,46.1 121.54,46.99 116.84,46.99 v116.78,47.05
  Top 0.406: C16.1 115.72,32.3 115.76,32.26 | 117.28,32.26 115.38,30.35 TP2.1
  Top 0.61: TR1B.11 97.72,41.85 TR1.5 | R32.2 C24.2 R33.2 | ZD3.A 117.54,49.47 v119.57,49.47 C14.2 120.33,49.47
  Top 1.016: C8.- 121.71,20.32 B1.-
  Top 1.27: 116.01,20.32 C8.- 116.14,29.27 C9.- 119,32.26 117.28,32.26 115.76,32.26 112.71,32.26
  Bottom 0.254: v117.22,38.42 116.78,38.42 | v117.41,35.37 116.78,35.37
  Bottom 0.305: v84.01,20.95 83.95,21.02 84.2,21.27 84.2,35.05 90.68,41.53 96.38,41.53 TR1.5
  Bottom 0.813: 116.78,42.35 116.78,38.42 116.78,35.37 116.78,33.91 118.43,32.26 119,32.26 C9.- | 116.78,42.35 TR1.5 | 116.78,42.35 v116.78,45.34 v116.78,47.05 119.19,49.47 v119.57,49.47
  pour Top (isolate 0.254, no thermals): 110.43,36.13 113.67,36.13 113.67,31.75 110.43,31.75
5VAC
  Top 0.61: D5.A 64.98,25.61 62.99,23.62 C17.2
  Top 0.762: TR1B.2 TR1B.3
  Top 0.813: TR1B.3 TR1B.4 76.58,36.77 76.96,36.39 76.96,30.1 76.14,29.27 74.12,29.27 TR1.11
  Top 1.778: D5.A 70.46,25.61 TR1.11
12VAC
  Top 0.61: C10.2 65.13,42.35 D2.A
  Top 1.016: TR1B.1 72.33,44.39 | 72.33,44.39 70.55,44.39 68.01,41.85 65.68,41.85 D2.A | TR1.7 72.21,44.5 72.33,44.39
+3V3  (via drill 0.4)
  Top 0.254: C5.2 R11.1
  Top 0.305: C6.2 44.77,38.35 44.51,38.61 IC1.6 | v60.13,38.42 60.13,42.55 61.34,43.75 67.94,43.75 68.9,44.7 68.9,48.96 X3.16
  Top 0.406: C5.2 v46.61,37.4 | v46.61,37.4 | v46.61,37.4 46.61,37.99 C6.2
  Bottom 0.305: v60.13,38.42 60.13,37.34 58.23,35.43 53.47,35.43 51.24,37.66 46.86,37.66 v46.61,37.4
+5V  (via drill 0.4)
  Top 0.305: LED2.A 13.12,28.04 v13.14,28.07 | v158.94,58.74 158.94,58.05 OK2.1 | R27.2 45.23,17.38 43.43,19.18 43.43,31.26 L4.2 45.87,34.04 40.89,34.04 37.53,37.4 R14.1 | C19.1 51.35,33.66 51.14,33.87 | v35.31,56.71 35.12,56.9 10.48,56.9 3.68,50.1 3.68,30.09 LED1.A
  Top 0.406: OK1.1 v138.37,58.74
  Top 1.778: L4.2 51.14,33.87 51.56,34.29 51.56,44.26 54.74,47.43 X3.5 X3.6
  Bottom 0.305: v13.14,28.07 5.7,28.07 LED1.A | v35.31,56.71 35.31,57.98 36.26,58.93 59.31,58.93
  Bottom 0.406: v158.94,58.74 158.75,58.93 138.56,58.93 v138.37,58.74 138.18,58.93 59.31,58.93 59.31,54.99 X3.6
+5V_REC
  Top 0.305: JP2.NO 63.63,22.42 58.93,17.72 53.47,17.72 C18.+
  Top 0.61: R23.1 61.91,29.95 61.98,30.01
  Top 1.778: D5.C 61.98,30.01 60.94,30.01 56.64,25.72 56.64,21.14 C18.+ 46.04,25.15 L4.1
+12V  (via drill 0.4, 0.6)
  Top 0.61: X3.4 52.2,53.53 53.98,55.31 65.28,55.31 v67.12,53.47 | v90.68,55.63 92.65,55.63 93.22,55.05 L1.2
  Top 1.016: X3.4 X3.3 | v53.4,41.91 53.4,36.64 53.91,36.13 C13.1 55.46,33.66 L3.2
  Bottom 0.61: v67.12,53.47 78.42,53.47 80.58,55.63 v90.68,55.63
  Bottom 1.016: X3.3 52.2,43.12 v53.4,41.91
+12V_REC  (via drill 0.4)
  Top 0.305: v69.15,27.5 69.15,30.8 67.56,32.38 59.98,32.38 L3.1 | JP2.NC 67.7,22.42 v69.09,23.81
  Top 1.016: L3.1 59.66,34.38 C12.+ 57.98,38.16 59.56,36.58 62.36,36.58 | 62.36,36.58 64.81,36.58 D2.C | R19.1 62.36,36.58
  Bottom 0.305: v69.09,23.81 69.09,27.43 v69.15,27.5
AC_L_IN
  Bottom 2.032: 172.34,16.83 151.76,16.83 140.97,6.03 112.71,6.03 107.38,11.37 102.68,11.37 97.35,6.03 36.83,6.03 33.47,9.4 33.47,22.42 21.97,33.91 20.57,33.91 19,35.48 SW1.1 | 172.34,16.83 172.15,17.02 VAR1.2 174.1,18.6 J1.L | 172.34,16.83 174.24,16.83 ZD2.A
AC_L_OUT
  Top 0.406: R4.2 147.26,41.72 Q2.A1
  Top 1.016: 122.11,9.59 123.3,9.59 B1.AC2
  Top 2.032: NTC1.1 139.79,14.69 137.73,12.64 125.16,12.64 122.11,9.59 114.24,9.59 108.9,14.92 101.16,14.92 95.82,9.59 38.35,9.59 37.02,10.92 37.02,23.94 32.07,28.89 32.07,41.97 28.44,45.6 C1.1
  Bottom 2.032: Q2.A1 151.19,37.85 151.7,38.35 160.53,38.35 163.19,35.69 163.19,30.61 160.21,27.62 155.77,27.62 152.21,24.07 145.54,24.07 139.79,18.31 NTC1.1 | SW1.1A 19,55.77 19.81,56.58 25.46,56.58 28.44,53.6 C1.1
AC_N_IN
  Bottom 2.032: ZD1.A 182.5,52.33 VAR2.1 182.5,41 J1.N 178.5,35.5 169.86,26.86 169.86,24.19 165.54,19.88 146.11,19.88 143.64,17.4 143.64,14.41 138.81,9.59 114.24,9.59 108.9,14.92 101.16,14.92 95.82,9.59 38.35,9.59 37.02,10.92 37.02,23.88 24,36.9 SW1.2
AC_N_OUT
  Top 1.016: B1.AC1 128.47,6.04 128.46,6.03
  Top 2.032: X1.5 150.3,9.46 149.74,8.9 R9.1 R10.1 133.99,8.9 131.13,6.03 128.46,6.03 112.71,6.03 107.38,11.37 102.68,11.37 97.35,6.03 36.83,6.03 33.47,9.4 33.47,22.35 30.57,25.24 29.46,26.36 28.44,27.38 C1.2
  Bottom 2.032: X1.5 X1.2 X2.2 | SW1.2A 24,46.87 28.44,42.43 C1.2
AC_OUT_L  (via drill 0.4)  (2 unrouted)
  Top 0.61: R5.2 146.24,44.89 | 146.24,44.89 148.72,44.89 R8.2 | v146.24,44.26 146.24,44.89
  Top 1.016: C2.1 147.96,15.11 150.75,15.11 152.2,13.66 X1.4
  Top 2.032: Q1.A2 145.73,25.08 152.4,18.41 156.08,18.41 158.18,16.32 158.18,13.72
  Bottom 0.61: Q2.A2 146.24,38.29 v146.24,44.26
  Bottom 2.032: X1.4 X1.1 X2.1 | Q2.A2 Q1.A2
AUX  (via drill 0.4)
  Top 0.254: R26.2 119.63,40.07 119.7,40.01 119.7,44.83 | 119.7,44.83 119.7,45.72 119.19,46.23 112.39,46.23 v111.32,47.31 | 108.84,53.85 108.84,54.25 D4.A | D6.A 119.73,44.8 119.7,44.83
  Top 0.406: C11.2 107.7,55.39 D4.A | 108.16,54.93 D4.A | TR1B.12 99.39,45.18 TR1.6 | v109.67,54.93 108.29,54.93 D4.A
  Bottom 0.406: TR1.6 97.23,47.36 99.06,45.53 109.16,45.53 110.74,47.12 110.74,47.37 | 110.74,47.37 110.74,53.85 v109.67,54.93 | v111.32,47.31 110.81,47.31 110.74,47.37
AUX_OUT  (via drill 0.4)
  Top 0.254: v117.98,36.51 117.79,36.7 114.68,36.7 114.11,36.13 114.11,35.88 114.02,35.79 C16.2 113.67,36.11 113.67,36.64 113.16,37.15 IC2.5
  Top 0.305: v120.27,52.26 C14.1
  Top 0.61: R22.2 119.06,55.63 | 119.06,55.63 119.06,55.5 C14.1 | ZD3.C 119.06,55.62 119.06,55.63
  Bottom 0.254: 118.46,46.96 118.17,46.67 118.17,36.7 v117.98,36.51
  Bottom 0.305: 118.46,46.96 120.78,49.28 120.78,51.75 v120.27,52.26
AUX_REC
  Top 0.406: D4.C 113.53,55.77 R21.1 R22.1
DC_BUS  (via drill 0.4)
  Top 0.305: v103.89,39.69 103.89,44.22 R18.1
  Top 1.016: TR1B.7 99.39,25.64 99.69,25.33
  Top 1.27: 105.85,25.19 R17.1 | R17.1 103.02,25.31 C7.1 99.69,25.33 99.24,25.33 TR1.2 | L2.P$2 109.7,26.9 108.14,25.34 105.75,25.34 R17.1
  Bottom 0.254: v103.89,39.69 103.89,34.04 TR1.2
  Bottom 1.27: L2.P$2 118.85,26.9 C9.+
FAN_OUT
  Top 0.813: X4.2 98.42,56.77 96.65,58.55 86.17,58.55 86.23,58.48 D1.A
  pour Top (isolate 0.305): 77.22,60.71 87.38,60.71 87.38,48.26 77.22,48.26
FAN_SENSE
  Top 0.254: X4.3 100.97,53.98 98.17,51.18 91.31,51.18 87.82,47.69 74.99,47.69 66.36,56.33 52.9,56.33 50.93,54.36 50.93,46.35 R15.2
  Top 0.305: R12.1 101.41,55.94 X4.3
FB1
  Top 0.305: OK3.2 76.71,17.34 75.5,16.13 R28.2 74.86,16.07 IC3.1 69.41,16.07 68.07,17.4 68.07,18.92 66.86,20.13 C23.1
GND  (via drill 0.4)
  Top 0.254: IC1.12 43.88,44.07 v43.88,43.5 | IC1.11 IC1.12 | IC1.13 IC1.12 | Q4.2 v74.11,56.07 | Q3.2 v72.96,52.13 | R16.2 47.37,45.21 v47.37,45.78 | C5.1 48.64,36.32 v48.26,35.88 | C6.1 v49.53,38.67 | v51.18,29.78 51.18,30.48 C19.2
  Top 0.305: R24.2 10.22,28.07 9.14,29.15 9.14,54.55 10.79,56.2 34.16,56.2 v34.61,55.75 | v39.75,41.66 39.75,41.85 Q6.2 | v73.03,15.05 IC3.3 | R34.1 v63.69,14.22 | IC1.5 43.88,38.67 v43.69,38.48 | Q5.3 83.27,52.54 v83.69,52.96
  Top 0.406: C3.2 v88.46,54.29 | C4.2 v91.63,53.98 | v53.53,29.72 53.53,30.48 C13.2
  Top 0.762: TR1B.5 TR1B.6
  Top 0.813: TR1B.5 73.79,34.23 72.2,35.81 TR1.9
  Bottom 0.305: 38.99,57.98 39.05,58.04 | v34.61,55.75 36.64,55.75
  Bottom 1.016: 72.17,37.4 TR1.9
  Bottom 1.778: C18.- 53.34,24.77 65.98,37.4 72.17,37.4
  other vias: 82.93,52.96 51.94,29.78 54.29,29.72 48.26,36.64 89.22,54.29
  pour Bottom (isolate 0.406): 79.76,12.45 42.42,12.45 42.16,12.7 42.16,28.96 36.32,34.8 36.32,59.94 92.2,59.94 92.2,50.29 79.76,50.29 77.98,48.77 77.98,38.86 65.53,38.86 52.07,25.4 52.07,22.35 54.61,22.35 54.61,24.13 66.29,35.81 77.98,35.81 79.76,34.04
HOLE_DL  (via drill 3.2 pad 5.5)
  other vias: 15,5.5
HOLE_DR  (via drill 3.2 pad 5.5)
  other vias: 191,5.5
HOLE_UL  (via drill 3.2 pad 5.5)
  other vias: 37,49.5
HOLE_UM  (via drill 3.2 pad 5.5)
  other vias: 105,49.5
HOLE_UR  (via drill 3.2 pad 5.5)
  other vias: 191,49.5
N$1  (via drill 0.4)
  Top 0.406: v148.53,26.42 149.61,26.42 R1.1
  Top 2.032: NTC1.2 134.87,16.13 140.27,21.53 Q1.A1
  Bottom 0.406: v148.53,26.42 143.06,26.42 140.27,29.21 Q1.A1
N$2
  Top 0.254: R15.1 R16.1 46.99,42.48 43.12,42.48 41.97,41.34 IC1.2
N$4
  Top 0.305: JP1.COM 88.39,14.41 C15.1
N$5
  Top 0.305: OK3.1 75.5,18.61 R28.1 R25.2
N$6
  Top 2.032: VAR1.1 174.69,32.32 SAR1.P$1
  Bottom 2.032: VAR2.2 175.45,49.97 177.1,48.32 177.1,42.93 175.1,40.93 174.75,40.58 172.15,37.97 SAR1.P$1
N$8
  Top 0.61: C10.1 R19.2
N$9
  Top 1.016: B1.+ 128.39,18.66 125.79,16.07 116.97,16.07 C8.+ 111.06,20.32 L2.P$1
  Top 1.27: C8.+ 115.97,15.24
N$10
  Top 0.305: R24.1 12.15,25.97 LED2.C
N$12
  Top 0.305: R25.1 70.1,19.75 68.64,21.21 65.72,21.21 65.55,21.38 JP2.COM
N$13
  Top 0.305: Q6.3 37.53,44.07 R13.2
N$14
  Top 0.305: 5.5,26 LED1.C 2.98,28.25 2.98,50.42 10.16,57.59 36.83,57.59 38.04,56.39 38.04,54.1 41.27,50.86 41.27,48.2 39.37,46.29 R13.1
N$16  (via drill 0.4)
  Top 0.305: R7.2 v143.51,57.85 | v76.26,57.02 Q4.3
  Bottom 0.305: v143.51,57.85 137.99,57.85 137.6,58.23 77.47,58.23 v76.26,57.02
N$20
  Top 0.254: R32.1 112.2,42.42 | 112.2,42.42 111.63,42.42 111.25,42.8 111.25,44.19 R20.2 | IC2.8 112.17,42.38 112.2,42.42
N$49
  Top 0.254: R18.2 R20.1
N$58  (via drill 0.4)
  Top 0.254: IC1.1 41.34,36.96 R11.2
  Top 0.305: v41.66,43.12 41.34,42.8 IC1.1
  Top 0.406: 78.74,51.18 78.65,51.27 Q5.1 77.72,52.44 77.72,57.21 76.64,58.29 53.09,58.29 v51.88,57.09
  Bottom 0.406: v41.66,43.12 41.66,49.91 48.83,57.09 v51.88,57.09
N$63  (via drill 0.4)
  Top 0.305: R12.2 v103.76,53.15
  Top 0.813: D1.C 88.45,53.03 C3.1 89.17,52.3 C4.1 93.22,52.3 | 93.22,52.3 94.53,52.3 95.89,53.66 X4.1 | L1.1 93.22,52.3
  Bottom 0.305: v103.76,53.15 96.9,53.15 95.89,54.17 X4.1
N$71
  Top 0.406: Q2.G 139.38,38.67 R4.1 139.38,47.68 OK1.6
N$72  (via drill 0.4)
  Top 0.406: R1.2 151.95,28.77 Q1.G | OK2.4 v152.6,48.7 v152.59,48.7
  Bottom 0.406: Q1.G 151.19,32.77 148.34,35.62 148.34,44.45 v152.59,48.7
N$73
  Top 0.406: R8.1 148.78,50.8 148.91,50.93 157.86,50.93 158.88,49.91 OK2.6
N$74
  Top 0.305: R2.2 R3.1
N$75
  Top 0.305: R6.2 R7.1
N$76
  Top 0.406: R5.1 144.08,50.93 144.15,50.99 134.24,50.99 133.29,50.04 OK1.4
N$83
  Top 0.813: R9.2 144.14,3.3 C2.2
  Top 1.016: R10.2 R9.2
N$137
  Top 0.813: D3.C 103.5,28.64 C7.2 105.71,28.13 R17.2
N$138  (via drill 0.4)
  Top 0.254: 116.33,42.1 C24.1 114.37,40.45 C21.2 114.37,40.13
  Top 0.305: OK3.4 84.93,19.84 v84.96,19.88 | IC2.7 112.23,39.75 v113.41,39.75 113.73,40.07 C21.2
  Bottom 0.305: v84.96,19.88 84.96,34.8 90.93,40.77 97.79,40.77 98.49,41.47 111.7,41.47 v113.41,39.75
N$140
  Top 0.406: R21.2 C11.1
N$141
  Top 0.254: R26.1 121.35,40 R29.1 | R31.2 114.36,37.85 115,37.21 117.47,37.21 118.36,38.1 R29.1 | C22.1 120.86,36.42 119.45,37.84 R29.1
  Top 0.305: IC2.6 R31.2
N$146
  Top 0.61: R23.2 C17.1
N$148  (via drill 0.4)
  Top 0.305: IC3.2 66.8,14.03 R34.2 C20.2 | R30.2 C20.2 | C20.2 v67.5,16.19 | v45.34,14.61 45.34,15.45 R27.1
  Bottom 0.305: v67.5,16.19 62.42,16.19 60.83,14.61 v45.34,14.61
N$149
  Top 0.305: C23.2 R30.1 C20.1
N$152
  Top 0.254: R33.1 118.3,41.85 116.78,40.32 116.52,40.32 C21.1
N$155
  Top 0.254: D6.C D7.C 122.62,42.01 122.62,38.48 122.24,38.1 R29.2
N$174
  Top 0.305: OK2.2 156.34,57.09 155.7,56.45 151.64,56.45 R6.1
N$175
  Top 0.305: OK1.2 135.83,57.02 135.45,56.64 130.81,56.64 R2.1
NFAULT  (via drill 0.4)
  Top 0.254: X3.15 66.17,49.15 66.17,51.12 63.31,53.98 56.26,53.98 56.07,54.17 v56.01,54.17 | IC1.8 45.79,41.47 v45.97,41.66
  Bottom 0.254: v56.01,54.17 54.29,52.45 48.45,52.45 46.23,50.23 46.23,41.91 v45.97,41.66
PE  (via drill 0.4, 3.2 pad 5.5)  (4 unrouted)
  Top 0.406: JP1.NC 93.41,13.14 98.87,18.61 v108.39,18.61 | v150.43,11.87 146.05,11.87 143.7,14.22 143.7,23.81 v142.62,24.89
  Top 1.016: X3.1 X3.2 49.66,56.71 47.69,58.67 7.27,58.67 SW1.PE2
  Top 2.032: J1.PE 190.5,33.97 179.61,44.86 SAR1.P$2 169.86,47.15 ZD1.C
  Bottom 0.406: v108.39,18.61 111.95,18.61 117.28,23.94 119.95,23.94 125.28,29.27 134.75,29.27 139.13,24.89 v142.62,24.89 | 150.5,1.97 150.37,2.1 150.43,2.29 v150.43,11.87
  Bottom 1.016: v105,5.5 105,2 105.03,1.97
  Bottom 1.524: J5.1 7.04,15.5 1.65,20.89 1.65,33.5 | SW1.PE1 1.65,33.5 | 1.65,33.5 1.65,53.05 SW1.PE2
  Bottom 2.032: 153.8,1.97 150.5,1.97 105.03,1.97 30.1,1.97 25.5,6.57 J5.1 | 153.8,1.97 158.37,1.97 | 158.37,1.97 167.64,1.97 | 167.64,1.97 175.13,1.97 | 175.13,1.97 180.34,1.97 | 180.34,1.97 185.17,1.97 J4.P$1 J4.P$2 185.55,25.05 J1.PE 193.29,27.21 ZD2.C | X1.6 153.98,2.15 153.8,1.97 | X1.3 158.18,2.15 158.37,1.97 | X2.3 167.51,2.1 167.64,1.97 | 175.13,1.97 J2.P$1 J2.P$2 | 180.34,1.97 J3.P$1 J3.P$2
PWR_DIR_OUT  (via drill 0.4)
  Top 0.254: Q6.1 v39.69,39.62 39.69,38.61 | v54.74,40.26 56.01,40.26 60.58,44.83 v67.63,44.83 | v76.26,55.31 Q3.3 v76.26,52.32
  Top 0.305: 39.69,38.61 R14.2 | R3.2 123.57,57.91 v122.87,57.21
  Bottom 0.254: v39.69,39.62 54.1,39.62 v54.74,40.26 | v76.26,52.32 76.26,47.31 73.79,44.83 v67.63,44.83
  Bottom 0.305: v122.87,57.21 122.62,57.47 78.42,57.47 v76.26,55.31
PWR_DIRECT  (via drill 0.4)
  Top 0.254: Q3.1 71.63,54.17 v69.15,56.64
  Bottom 0.254: X3.12 62.93,50.99 62.93,53.47 65.85,56.39 68.9,56.39 v69.15,56.64
PWR_SSTART  (via drill 0.4)
  Top 0.254: Q4.1 71.12,57.47 v70.29,56.64
  Bottom 0.254: X3.11 63.63,49.15 63.63,53.21 66.1,55.69 69.53,55.69 70.29,56.45 v70.29,56.64
SSCL  (via drill 0.4)
  Top 0.254: IC1.16 41.34,47.12 41.91,47.69 v44.26,47.69 | X3.13 63.63,49.15 63.63,52.07 62.8,52.9 54.1,52.9 v53.66,53.34
  Bottom 0.254: v44.26,47.69 44.26,50.48 47.12,53.34 v53.66,53.34
SSDA  (via drill 0.4)
  Top 0.254: X3.14 64.9,51.56 63.06,53.4 55.18,53.4 v54.55,54.04 | v42.55,46.74 42.23,46.74 41.97,46.48 IC1.15
  Bottom 0.254: v54.55,54.04 46.86,54.04 42.42,49.59 42.42,46.86 v42.55,46.74
TEMP1_N
  Top 0.254: IC1.9 45.79,45.97 45.72,46.04 45.72,49.19 41.27,53.64 41.27,55.24 41.91,55.88 X5.2
TEMP1_P
  Top 0.254: IC1.10 45.15,45.98 45.21,46.04 45.21,48.98 40.77,53.42 40.77,55.24 40.13,55.88 X5.1
VIPER_D
  Top 0.305: TP1.1 101.85,35.63
  Top 1.27: TR1.4 98.79,37.36 TR1B.9 100.52,35.63 101.85,35.63 D3.A 103.5,35.5 103.57,35.43 106.62,35.43 106.68,35.37
  pour Top (isolate 0.305, no thermals): 100.33,36.13 108.08,36.13 108.08,31.75 105.92,31.75 105.92,32.89 105.6,33.21 102.23,33.21 100.33,35.12

### Text on the board
Bottom: EEZ DIB AUX PS (09/2018 r1B1)
tPlace: +5V | Project source code: github.com/eez-open/modular-psu | EEZ DIB AUX PS / (09/2018 r1B1) | CAUTION! / HIGH VOLTAGE